# Altium schematic sheet Power.SchDoc
size A4; Organization: UltraZohm; DocumentNumber: 8; SheetNumber: 8; SheetTotal: 11; Website: www.ultrazohm.com
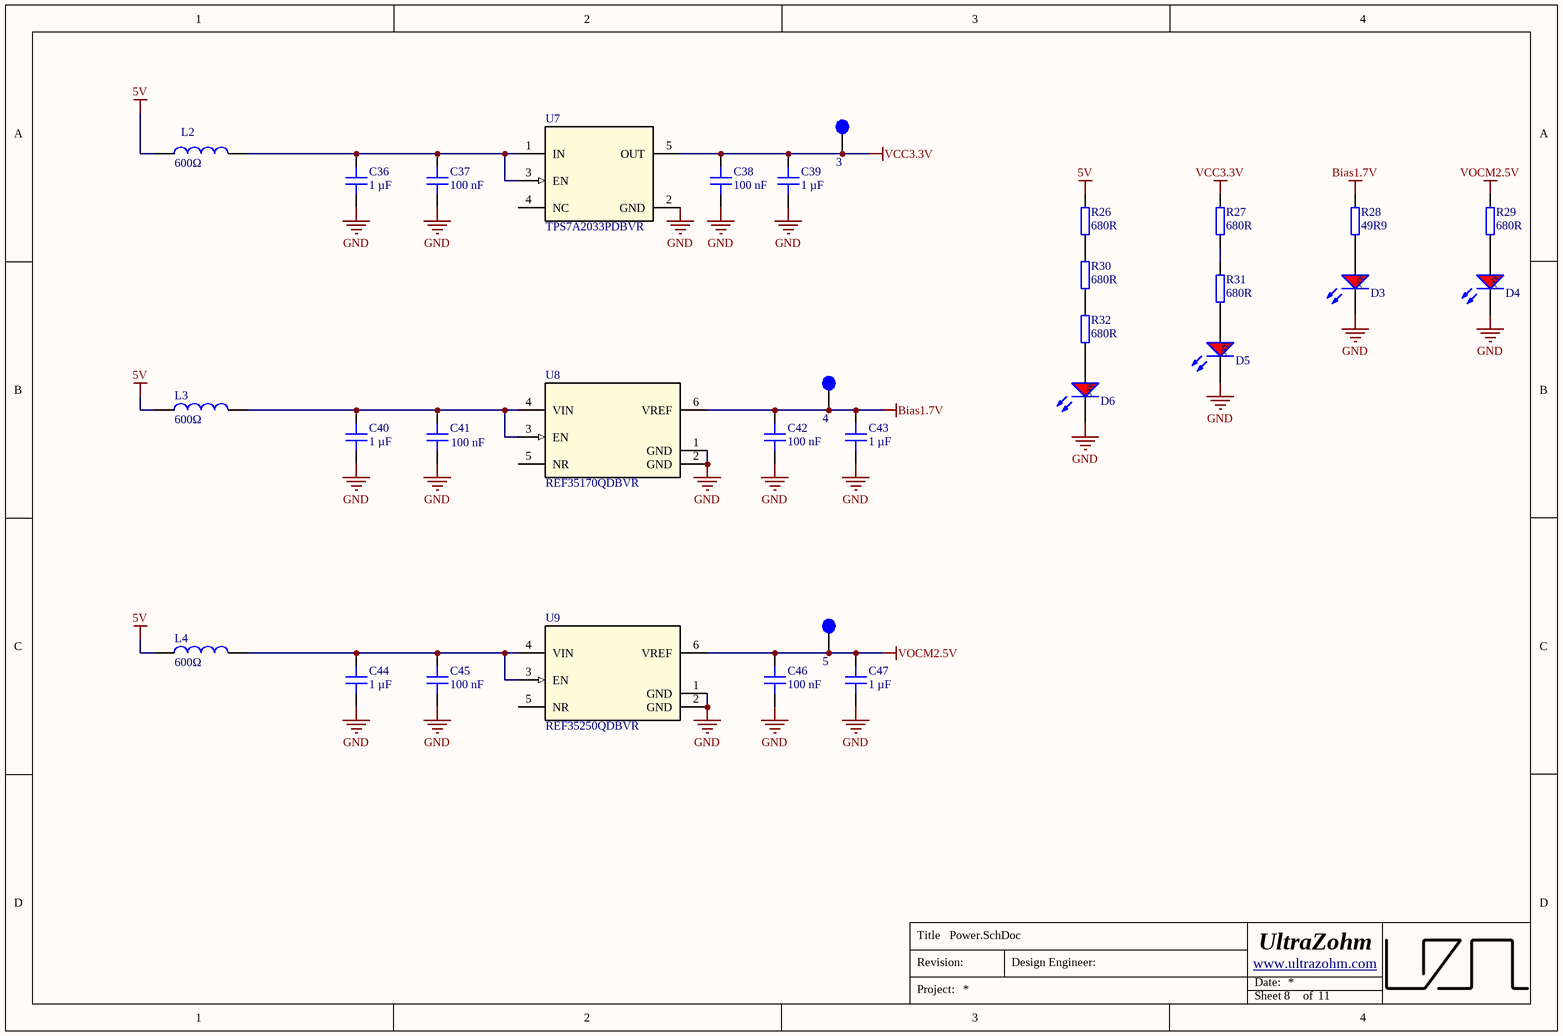
[diagram p0: Power.SchDoc]

## Parts
3  Testpoint 1mm  [TP_1mm]  (value not drawn)  (no BOM)
4  Testpoint 1mm  [TP_1mm]  (value not drawn)  (no BOM)
5  Testpoint 1mm  [TP_1mm]  (value not drawn)  (no BOM)
C36  1 µF  [C_0603]
C37  100 nF  [C_0603]
C38  100 nF  [C_0603]
C39  1 µF  [C_0603]
C40  1 µF  [C_0603]
C41  100 nF  [C_0603]
C42  100 nF  [C_0603]
C43  1 µF  [C_0603]
C44  1 µF  [C_0603]
C45  100 nF  [C_0603]
C46  100 nF  [C_0603]
C47  1 µF  [C_0603]
D3  150060RS75000  [WL-SMCW_0603]  (value not drawn)
D4  150060RS75000  [WL-SMCW_0603]  (value not drawn)
D5  150060RS75000  [WL-SMCW_0603]  (value not drawn)
D6  150060RS75000  [WL-SMCW_0603]  (value not drawn)
L2  600Ω  [WE-CBF_0805_High Current]
L3  600Ω  [WE-CBF_0805_High Current]
L4  600Ω  [WE-CBF_0805_High Current]
R26  680R  [R_0603_N]
R27  680R  [R_0603_N]
R28  49R9  [RES 0603_1608]
R29  680R  [R_0603_N]
R30  680R  [R_0603_N]
R31  680R  [R_0603_N]
R32  680R  [R_0603_N]
U7  TPS7A2033PDBVR  [DBV0005A-IPC_A]
U8  REF35170QDBVR  [DBV0006A-IPC_A]
U9  REF35250QDBVR  [DBV0006A-IPC_A]

## Nets
5V: L2.1 L3.1 L4.1 R26.2
Bias1.7V: 4.1 C42.1 C43.1 R28.1 U8.6(VREF)
GND: C36.2 C37.2 C38.2 C39.2 C40.2 C41.2 C42.2 C43.2 C44.2 C45.2 C46.2 C47.2 D3.1(K) D4.1(K) D5.1(K) D6.1(K) U7.2(GND) U8.1(GND) U8.2(GND) U9.1(GND) U9.2(GND)
VCC3.3V: 3.1 C38.1 C39.1 R27.2 U7.5(OUT)
VOCM2.5V: 5.1 C46.1 C47.1 R29.2 U9.6(VREF)
NetC36_1: C36.1 C37.1 L2.2 U7.1(IN) U7.3(EN)
NetC40_1: C40.1 C41.1 L3.2 U8.3(EN) U8.4(VIN)
NetC44_1: C44.1 C45.1 L4.2 U9.3(EN) U9.4(VIN)
NetD3_2: D3.2(A) R28.2
NetD4_2: D4.2(A) R29.1
NetD5_2: D5.2(A) R31.1
NetD6_2: D6.2(A) R32.1
NetR26_1: R26.1 R30.2
NetR27_1: R27.1 R31.2
NetR30_1: R30.1 R32.2

Not connected (* = marked no-connect by the designer): U7 4(NC); U8 5(NR); U9 5(NR)

## Notes on the sheet
- Title
- Revision:
- Design Engineer:
- Date:
- Project:
- Sheet
- of

## Library data of the parts
3-5 = TP_1mm: Created: 2018_06_25_AGeiger; Value: Testpoint 1mm
C36 C39 C40 C43 C44 C47 = C0603C105K3RAC7411: Capacitor 0603, 25 VDC, 1 µF, X7R; Manufacturer: KEMET; Tolerance: 10 %; Voltage Rating: 25 VDC; Created from: MGremer; Manufacturer Part Number: C0603C105K3RAC7411; PartID: 4; Created On: 20/12/2020 13:54:13; ComponentLink1Description: Datasheet; ComponentLink1URL: https://www.mouser.de/datasheet/2/212/KEM_C1002_X7R_SMD-1102033.pdf; Component Type: Capacitor 0603; Device Package: 0603; Last Updated: 20/12/2020 16:43:05; Mounting Type: SMD; Operating Temperature: -55 - 125°C; Series: SMD Comm X7R; Supplier 1: Mouser; Supplier Part Number 1: 80-C0603C105K3RLR; Type: Capacitor; Value: 1 µF; Live Cycle Status: 1; Stock number: Labor SMD Container; LCSC Part Number: C29936
C37 C38 C41 C42 C45 C46 = C0603C104K5RAC3121: Capacitor 0603, 50 VDC, 100nF, X7R; Manufacturer: KEMET; Tolerance: 10 %; Voltage Rating: 50 VDC; Created from: DHufnagel; Manufacturer Part Number: C0603C104K5RAC3121; PartID: 99; Created On: 11/08/2022 14:33:29; ComponentLink1Description: Datasheet; ComponentLink1URL: https://www.mouser.de/datasheet/2/212/KEM_C1023_X7R_AUTO_SMD-1093309.pdf; Component Type: Capacitor 0603; Device Package: 0603; Last Updated: 19/08/2022 08:26:58; Mounting Type: SMD; Operating Temperature: -55 - 125°C; Series: X7R; Supplier 1: Mouser; Supplier Part Number 1: 80-C603C104K5RAC3121; Supplier 2: LCSC; Supplier Part Number 2: C14663; Type: Capacitor; Value: 100 nF; Live Cycle Status: 1; LCSC Part Number: C14663; Stock number: not stored
D3-D6 = LED_Red_0603: WL-SMCW SMD Mono-color Chip LED Waterclear, size 0603, Red, 2 V, 140°; Forward Voltage: 2 V; Luminous Intensity: 250 mcd; Peak Wavelength: 630 nm; Dominant Wavelength: 625 nm; MF: Wuerth Elektronik; Published Date: Sep. 2017; ComponentLink1Description: Manufacturer; ComponentLink1URL: http://www.we-online.de; ComponentLink2Description: Datasheet; ComponentLink2URL: http://katalog.we-online.com/led/datasheet/150060RS75000.pdf; MPN: 150060RS75000; Size: 0603; Viewing Angle: 140°; Emitting Color: Red; Value: 150060RS75000; Package: 0603; Created: 2018_09_06_AGeiger; Supplier 1: Farnell; Supplier Part Number 1: 2322071; Supplier 2: Mouser; Supplier Part Number 2: 710-150060RS75000; Supplier 3: Digi-Key; Supplier Part Number 3: 732-4978-1-ND; LCSC Part Number: C2286
L2-L4 = WE-CBF, 742792040: WE-CBF SMD EMI Suppression Ferrite Bead, 0805, 600Ω; MF: Wurth Elektronik; Type: High Current; PublishedDate: Aug 2016; ComponentLink1Description: Manufacturer; ComponentLink1URL: http://www.we-online.de; ComponentLink2Description: Datasheet; ComponentLink2URL: http://katalog.we-online.de/pbs/datasheet/742792040.pdf; MPN: 742792040; Value: 600Ω; Package: 0805; Supplier 1: Farnell; Supplier 2: Mouser; Supplier 3: Digi-Key; Supplier Part Number 1: 2761567; Supplier Part Number 2: 710-742792040; Supplier Part Number 3: 732-1620-1-ND; LCSC Part Number: C98308
R26 R27 R29-R32 = R_0603: SMD Resistor 0603; MPN: CR0603-FX-3901ELF; Tolerance: 1%; Voltage: 75V; Power: 100 mW; MF: Bourns; Package: 0603; Value: 680R; Created: 2018_09_06_AGeiger; Supplier 1: Mouser; Supplier Part Number 1: 652-CR0603-FX3901ELF; LCSC Part Number: C23228
R28 = RK73H1JTTD49R9F: SMD resistor 1%; Manufacturer: KOA Speer; Created from: DHufnagel; Manufacturer Part Number: RK73H1JTTD49R9F; PartID: 214; Created On: 14.12.2020 16:17:14; ComponentLink1Description: Datasheet; ComponentLink1URL: https://www.mouser.de/datasheet/2/219/RK73H-1825326.pdf; Component Type: SMD resistor; Device Package: 0603; Last Updated: 27.05.2022 13:46:35; Mounting Type: SMD; Supplier 1: Mouser; Supplier Part Number 1: 660-RK73H1JTTD49R9F; Supplier 2: LCSC; Supplier Part Number 2: C160046; Type: Resistor; Tolerance: 1%; Value: 49R9; Live Cycle Status: 1; Stock number: not stored; LCSC Part Number: C160046
U7 = TPS7A2033PDBVR: No Description Available; Mfr_Name: Texas Instruments; TYPE: TYPE; RefDes: RefDes; LCSC Part Number: C2862740
U8 = REF35170QDBVR: No Description Available; Mfr_Name: Texas Instruments; TYPE: TYPE; RefDes: RefDes; LCSC Part Number: C20345634
U9 = REF35250QDBVR: No Description Available; Mfr_Name: Texas Instruments; TYPE: TYPE; RefDes: RefDes; LCSC Part Number: C6265005